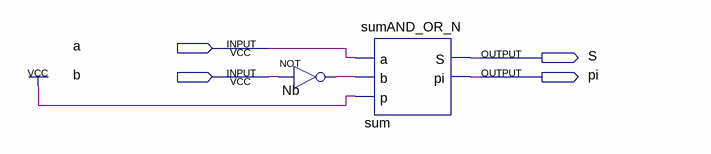
[diagram p0: schematic sheet]
// Quartus schematic sub.bdf as structural Verilog: 2 symbols, 4 pins
module sub (
  input  a,
  input  b,
  output S,
  output pi
);

  wire Nb_out;

  not Nb (Nb_out, b);
  sumAND_OR_N sum (.a(a), .b(Nb_out), .p(1'b1), .S(S), .pi(pi));
endmodule
